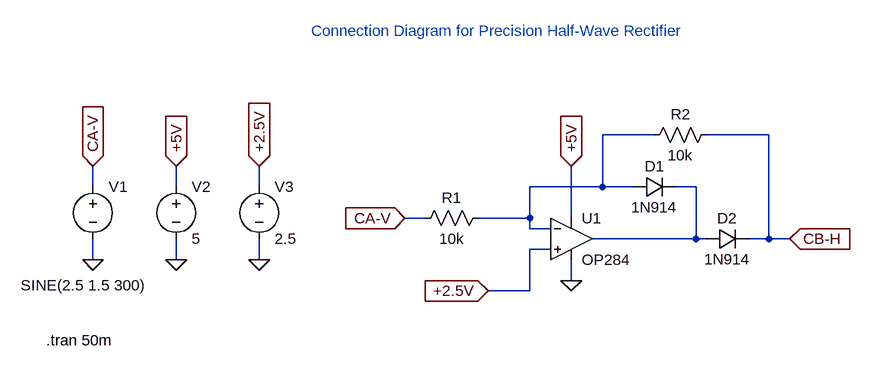
[diagram p0: schematic precision_half_wave_rect_ltspice.asc]
precision_half_wave_rect_ltspice.asc, the LTspice schematic file:
Version 4
SHEET 1 880 680
WIRE 352 32 272 32
WIRE 528 32 432 32
WIRE -512 112 -512 80
WIRE -384 112 -384 80
WIRE -256 112 -256 80
WIRE 272 112 272 32
WIRE 272 112 160 112
WIRE 320 112 272 112
WIRE 416 112 384 112
WIRE 0 160 -32 160
WIRE 160 160 160 112
WIRE 160 160 80 160
WIRE 224 160 224 80
WIRE 160 176 160 160
WIRE 192 176 160 176
WIRE 416 192 416 112
WIRE 416 192 256 192
WIRE 432 192 416 192
WIRE 528 192 528 32
WIRE 528 192 496 192
WIRE 560 192 528 192
WIRE 192 208 160 208
WIRE -512 224 -512 192
WIRE -384 224 -384 192
WIRE -256 224 -256 192
WIRE 224 256 224 224
WIRE 160 272 160 208
WIRE 160 272 96 272
FLAG 560 192 CB-H
IOPIN 560 192 In
FLAG -32 160 CA-V
IOPIN -32 160 In
FLAG 224 256 0
FLAG 224 80 +5V
IOPIN 224 80 In
FLAG 96 272 +2.5V
IOPIN 96 272 In
FLAG -512 224 0
FLAG -384 224 0
FLAG -256 224 0
FLAG -512 80 CA-V
IOPIN -512 80 In
FLAG -384 80 +5V
IOPIN -384 80 In
FLAG -256 80 +2.5V
IOPIN -256 80 In
SYMBOL Opamps\\OP284 224 128 R0
SYMATTR InstName U1
SYMBOL res 96 144 R90
WINDOW 0 0 56 VBottom 2
WINDOW 3 32 56 VTop 2
SYMATTR InstName R1
SYMATTR Value 10k
SYMBOL res 448 16 R90
WINDOW 0 0 56 VBottom 2
WINDOW 3 32 56 VTop 2
SYMATTR InstName R2
SYMATTR Value 10k
SYMBOL diode 320 128 R270
WINDOW 0 32 32 VTop 2
WINDOW 3 0 32 VBottom 2
SYMATTR InstName D1
SYMATTR Value 1N914
SYMBOL diode 432 208 R270
WINDOW 0 32 32 VTop 2
WINDOW 3 0 32 VBottom 2
SYMATTR InstName D2
SYMATTR Value 1N914
SYMBOL voltage -512 96 R0
WINDOW 3 -111 167 Left 2
WINDOW 123 0 0 Left 0
WINDOW 39 0 0 Left 0
SYMATTR InstName V1
SYMATTR Value SINE(2.5 1.5 300)
SYMBOL voltage -384 96 R0
WINDOW 123 0 0 Left 0
WINDOW 39 0 0 Left 0
SYMATTR InstName V2
SYMATTR Value 5
SYMBOL voltage -256 96 R0
WINDOW 123 0 0 Left 0
WINDOW 39 0 0 Left 0
SYMATTR InstName V3
SYMATTR Value 2.5
TEXT -176 -128 Left 2 ;Connection Diagram for Precision Half-Wave Rectifier
TEXT -584 348 Left 2 !.tran 50m

The netlist it stands for:
* precision_half_wave_rect_ltspice.asc
XU1 +2.5V N001 +5V 0 N002 OP284  ; pins In+ In- V+ V- OUT
R1 N001 CA-V 10k
R2 CB-H N001 10k
D1 N001 N002 1N914
D2 N002 CB-H 1N914
V1 CA-V 0 SINE(2.5 1.5 300)
V2 +5V 0 5
V3 +2.5V 0 2.5
.model D D
.lib standard.dio
* Connection Diagram for Precision Half-Wave Rectifier
.tran 50m
.lib ADI1.lib
.backanno
.end